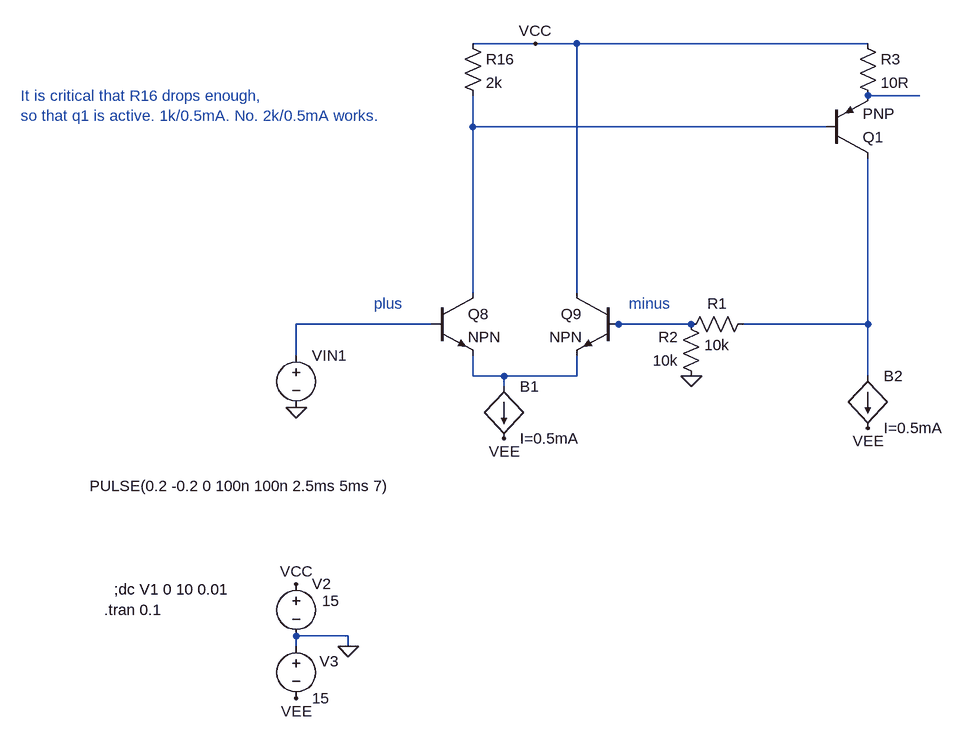
[diagram p0: schematic Draft40.asc]
Draft40.asc, the LTspice schematic file:
Version 4
SHEET 1 1648 868
WIRE -768 -608 -864 -608
WIRE -704 -608 -768 -608
WIRE -256 -608 -704 -608
WIRE -176 -528 -256 -528
WIRE -864 -480 -864 -528
WIRE -320 -480 -864 -480
WIRE -864 -224 -864 -480
WIRE -704 -224 -704 -608
WIRE -928 -176 -1136 -176
WIRE -640 -176 -656 -176
WIRE -528 -176 -640 -176
WIRE -256 -176 -256 -432
WIRE -256 -176 -448 -176
WIRE -1136 -128 -1136 -176
WIRE -864 -96 -864 -128
WIRE -816 -96 -864 -96
WIRE -704 -96 -704 -128
WIRE -704 -96 -816 -96
WIRE -256 -96 -256 -176
WIRE -816 -80 -816 -96
WIRE -1056 304 -1136 304
WIRE -1136 320 -1136 304
WIRE -1056 320 -1056 304
FLAG -1056 320 0
FLAG -1136 224 VCC
FLAG -1136 400 VEE
FLAG -1136 -48 0
FLAG -816 0 VEE
FLAG -528 -96 0
FLAG -768 -608 VCC
FLAG -256 -16 VEE
SYMBOL voltage -1136 208 R0
WINDOW 123 0 0 Left 0
WINDOW 39 0 0 Left 0
WINDOW 3 40 42 Left 2
SYMATTR Value 15
SYMATTR InstName V2
SYMBOL voltage -1136 304 R0
WINDOW 123 0 0 Left 0
WINDOW 39 0 0 Left 0
WINDOW 0 36 39 Left 2
SYMATTR InstName V3
SYMATTR Value 15
SYMBOL bi -816 -80 R0
SYMATTR InstName B1
SYMATTR Value I=0.5mA
SYMBOL res -880 -624 R0
SYMATTR InstName R16
SYMATTR Value 2k
SYMBOL npn -928 -224 R0
SYMATTR InstName Q8
SYMBOL npn -640 -224 M0
SYMATTR InstName Q9
SYMBOL voltage -1136 -144 R0
WINDOW 123 0 0 Left 0
WINDOW 39 0 0 Left 0
WINDOW 3 -318 217 Left 2
SYMATTR Value PULSE(0.2 -0.2 0 100n 100n 2.5ms 5ms 7)
SYMATTR InstName VIN1
SYMBOL res -432 -192 R90
WINDOW 0 0 56 VBottom 2
WINDOW 3 32 56 VTop 2
SYMATTR InstName R1
SYMATTR Value 10k
SYMBOL res -512 -80 R180
WINDOW 0 36 76 Left 2
WINDOW 3 36 40 Left 2
SYMATTR InstName R2
SYMATTR Value 10k
SYMBOL pnp -320 -432 M180
SYMATTR InstName Q1
SYMBOL res -272 -624 R0
SYMATTR InstName R3
SYMATTR Value 10R
SYMBOL bi -256 -96 R0
SYMATTR InstName B2
SYMATTR Value I=0.5mA
TEXT -1416 232 Left 2 !;dc V1 0 10 0.01
TEXT -1432 264 Left 2 !.tran 0.1
TEXT -1016 -208 Left 2 ;plus
TEXT -1560 -528 Left 2 ;It is critical that R16 drops enough, \nso that q1 is active. 1k/0.5mA. No. 2k/0.5mA works.
TEXT -624 -208 Left 2 ;minus

The netlist it stands for:
* Draft40.asc
V2 VCC 0 15
V3 0 VEE 15
B1 N006 VEE I=0.5mA
R16 VCC N002 2k
Q8 N002 N003 N006 0 NPN
Q9 VCC N004 N006 0 NPN
VIN1 N003 0 PULSE(0.2 -0.2 0 100n 100n 2.5ms 5ms 7)
R1 N005 N004 10k
R2 0 N004 10k
Q1 N005 N002 N001 0 PNP
R3 VCC N001 10R
B2 N005 VEE I=0.5mA
.model NPN NPN
.model PNP PNP
.lib standard.bjt
;dc V1 0 10 0.01
.tran 0.1
* plus
* It is critical that R16 drops enough,
* so that q1 is active. 1k/0.5mA. No. 2k/0.5mA works.
* minus
.backanno
.end